# EAGLE design 07_LOAD_DestinationRegister (EAGLE 7.5.0)
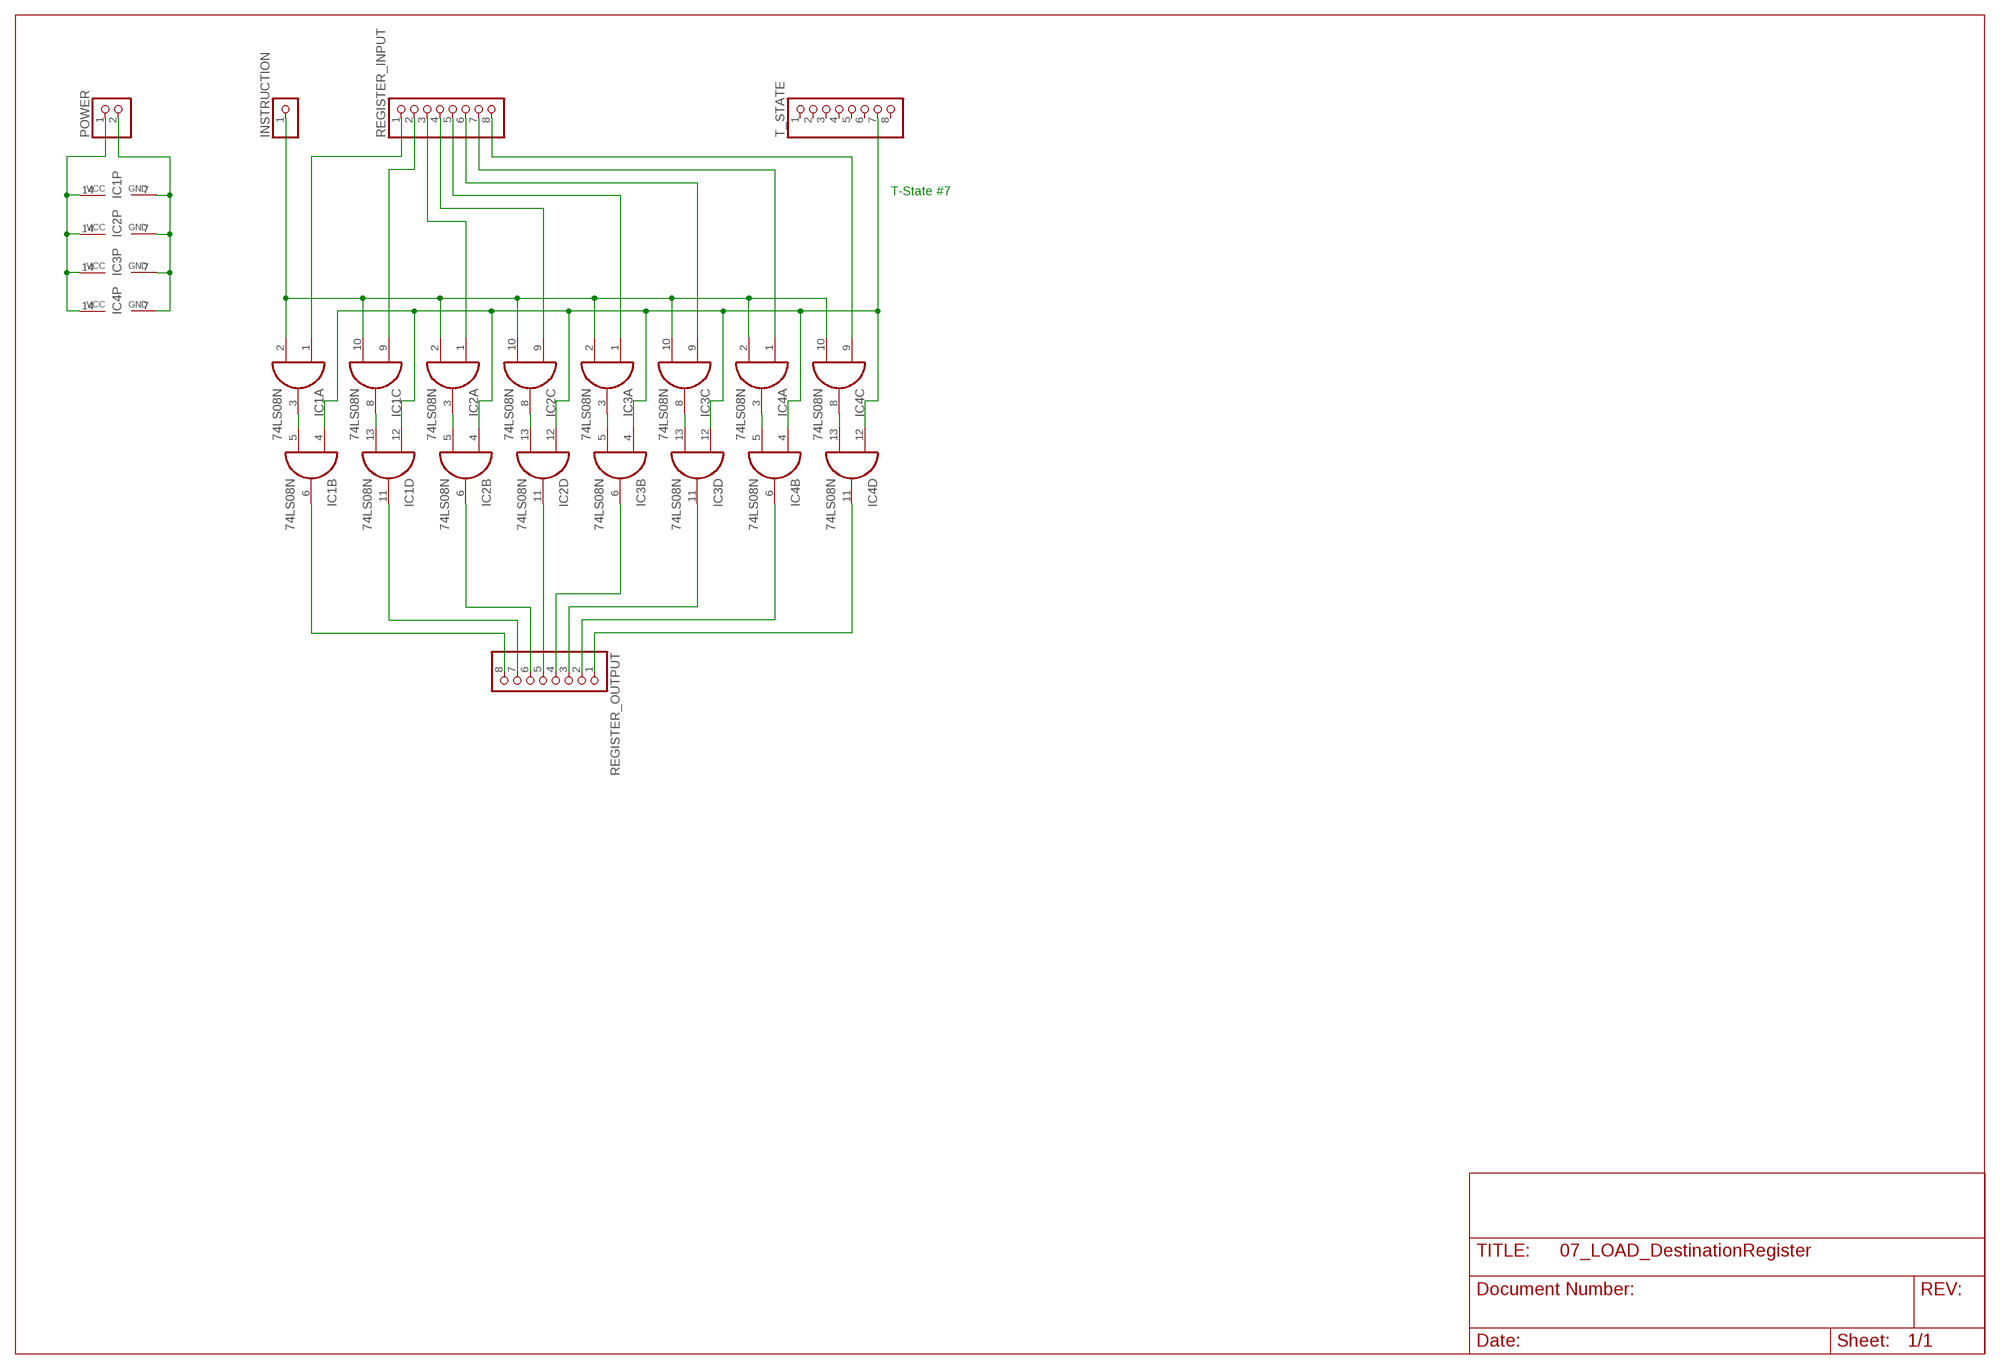
[diagram p0: schematic, sheet 1]

## Parts
IC1  74LS08N  [DIL14]
IC2  74LS08N  [DIL14]
IC3  74LS08N  [DIL14]
IC4  74LS08N  [DIL14]
INSTRUCTION  PINHD-1X1  [1X01]
POWER  PINHD-1X2  [1X02]
REGISTER_INPUT  PINHD-1X8  [1X08]
REGISTER_OUTPUT  PINHD-1X8  [1X08]
T_STATE  PINHD-1X8  [1X08]

## Nets
GND: IC1.7(P:GND) IC2.7(P:GND) IC3.7(P:GND) IC4.7(P:GND) POWER.2
N$1: IC1.2(A:I1) IC1.10(C:I1) IC2.2(A:I1) IC2.10(C:I1) IC3.2(A:I1) IC3.10(C:I1) IC4.2(A:I1) IC4.10(C:I1) INSTRUCTION.1
N$2: IC1.1(A:I0) REGISTER_INPUT.1
N$3: IC1.3(A:O) IC1.5(B:I1)
N$4: IC4.9(C:I0) REGISTER_INPUT.8
N$5: IC1.9(C:I0) REGISTER_INPUT.2
N$6: IC1.8(C:O) IC1.13(D:I1)
N$7: IC2.1(A:I0) REGISTER_INPUT.3
N$8: IC2.3(A:O) IC2.5(B:I1)
N$9: IC2.9(C:I0) REGISTER_INPUT.4
N$10: IC2.8(C:O) IC2.13(D:I1)
N$11: IC3.1(A:I0) REGISTER_INPUT.5
N$12: IC3.3(A:O) IC3.5(B:I1)
N$13: IC3.9(C:I0) REGISTER_INPUT.6
N$14: IC3.8(C:O) IC3.13(D:I1)
N$15: IC4.1(A:I0) REGISTER_INPUT.7
N$16: IC4.3(A:O) IC4.5(B:I1)
N$17: IC1.4(B:I0) IC1.12(D:I0) IC2.4(B:I0) IC2.12(D:I0) IC3.4(B:I0) IC3.12(D:I0) IC4.4(B:I0) IC4.12(D:I0) T_STATE.7
N$18: IC4.8(C:O) IC4.13(D:I1)
N$19: IC1.6(B:O) REGISTER_OUTPUT.8
N$20: IC1.11(D:O) REGISTER_OUTPUT.7
N$21: IC2.6(B:O) REGISTER_OUTPUT.6
N$22: IC2.11(D:O) REGISTER_OUTPUT.5
N$23: IC3.6(B:O) REGISTER_OUTPUT.4
N$24: IC3.11(D:O) REGISTER_OUTPUT.3
N$25: IC4.6(B:O) REGISTER_OUTPUT.2
N$26: IC4.11(D:O) REGISTER_OUTPUT.1
VCC: IC1.14(P:VCC) IC2.14(P:VCC) IC3.14(P:VCC) IC4.14(P:VCC) POWER.1
Unconnected: T_STATE.1 T_STATE.2 T_STATE.3 T_STATE.4 T_STATE.5 T_STATE.6 T_STATE.8

## Notes on the sheet
- T-State #7

## Library data of the parts
IC1-IC4 = 74xx-eu:74*08: Quad 2-input AND gate
INSTRUCTION = pinhead:PINHD-1X1: PIN HEADER
POWER = pinhead:PINHD-1X2: PIN HEADER
REGISTER_INPUT REGISTER_OUTPUT T_STATE = pinhead:PINHD-1X8: PIN HEADER

## Board
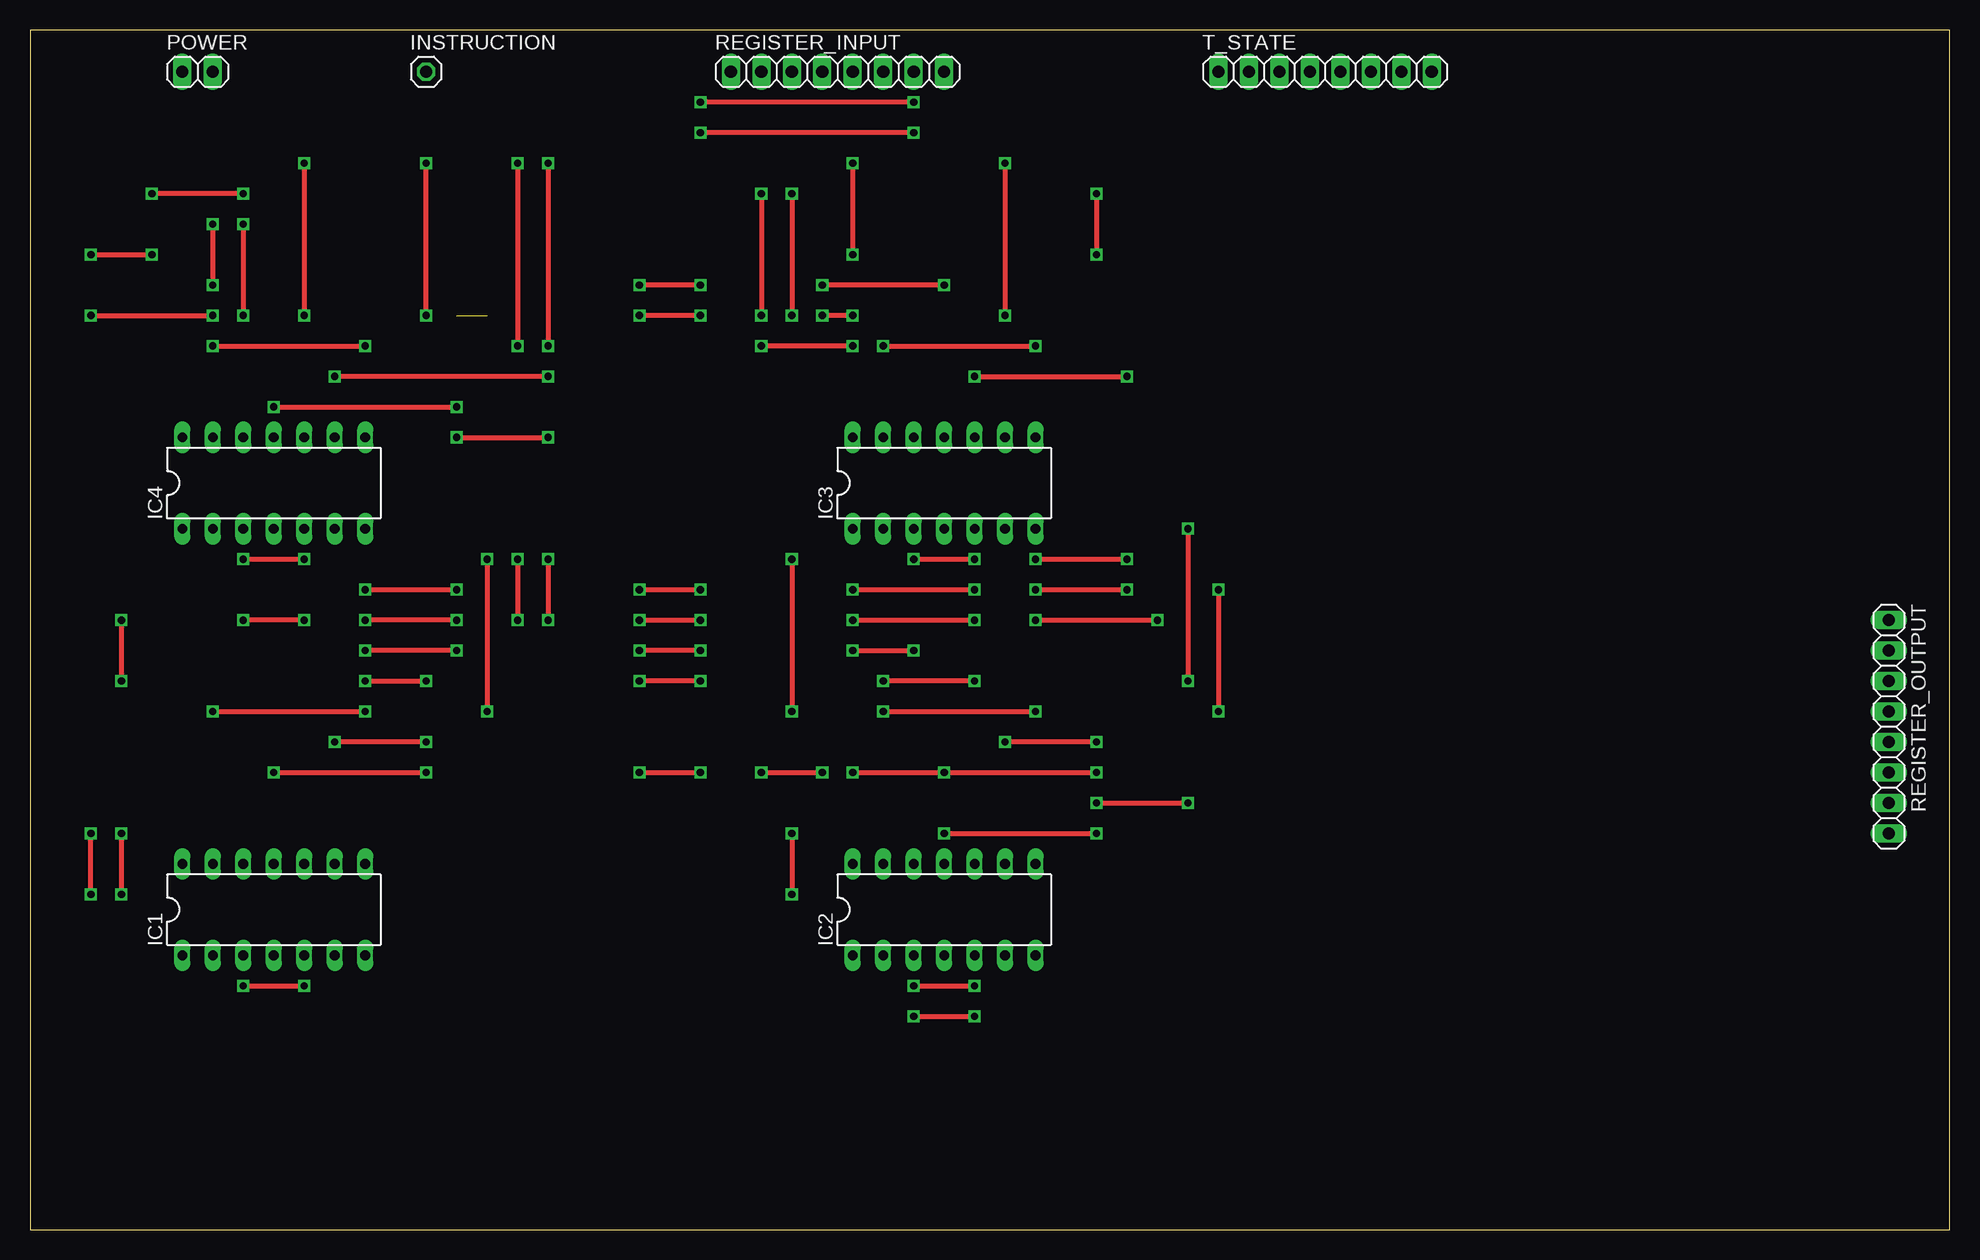
[diagram p1: board, top side]
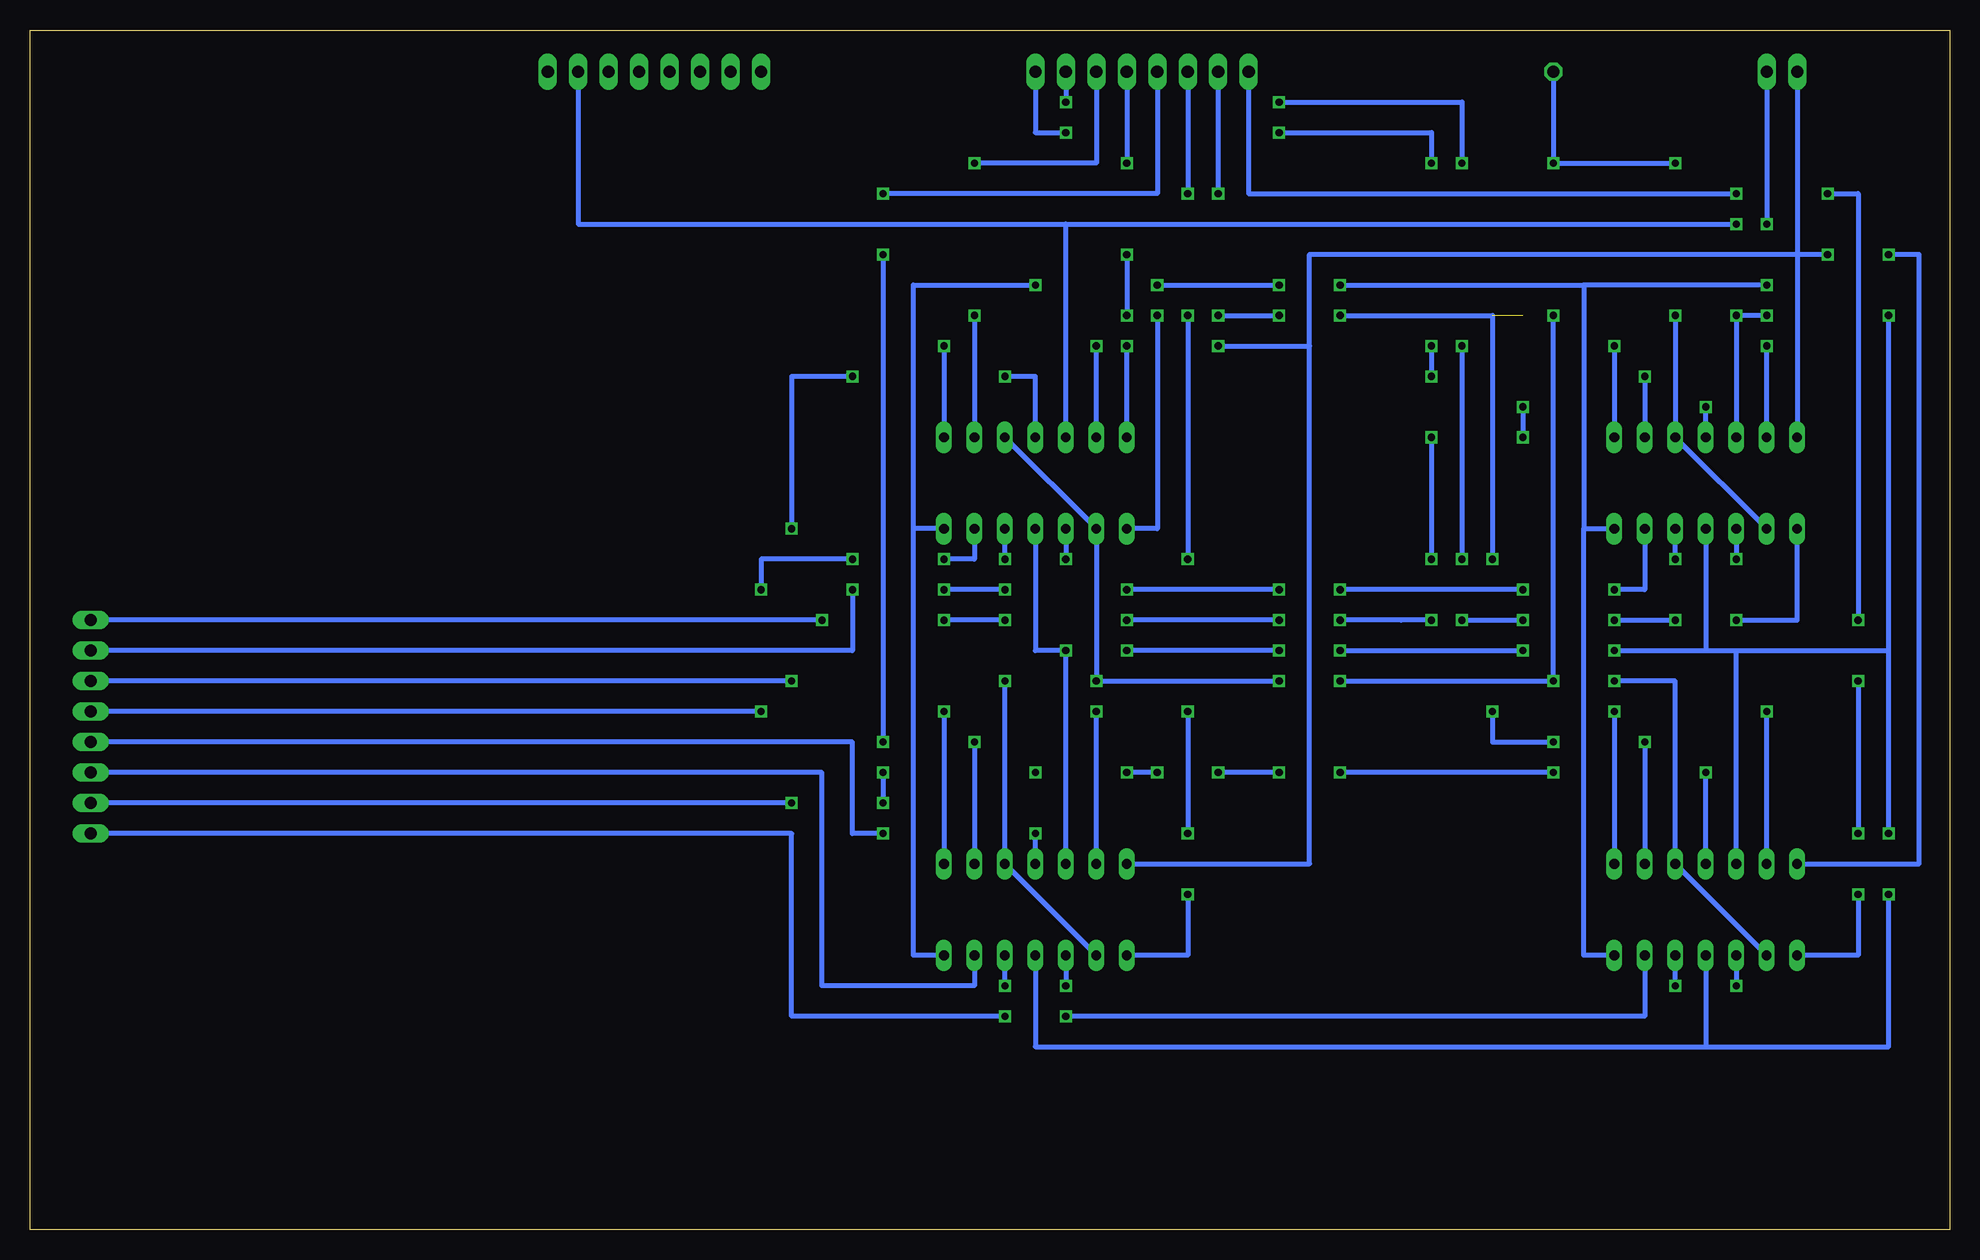
[diagram p2: board, bottom side, seen from below]

Size 160 x 100 mm. Coordinates in mm from the lower left corner, seen from the top.
Outline: 0,0 160,0 160,100 0,100 0,0
Copper layers (1*16): Top 0.035mm / dielectric 1.5mm / Bottom 0.035mm
Design rules "default": minimum track width 10mil, minimum drill 24mil, track to track 8mil, track to pad 8mil, pad to pad 8mil, via to via 8mil, smd to smd 8mil, copper to edge 40mil, drill to drill 8mil, minimum pad ring 10mil, minimum via ring 8mil, stop-mask expansion 4mil, vias tented up to drill 0mil, thermal gap 10mil

### Footprints (pad centres in the part's own frame; a part is rotated, then mirrored left to right if it is on the bottom)
DIL14 = drill 0.813 long: 1 -7.62,-3.81; 2 -5.08,-3.81; 3 -2.54,-3.81; 4 0,-3.81; 5 2.54,-3.81; 6 5.08,-3.81; 7 7.62,-3.81; 8 7.62,3.81; 9 5.08,3.81; 10 2.54,3.81; 11 0,3.81; 12 -2.54,3.81; 13 -5.08,3.81; 14 -7.62,3.81
1X01 = drill 1.016 octagon: 1 0,0
1X02 = drill 1.016 long: 1 -1.27,0; 2 1.27,0
1X08 = drill 1.016 long: 1 -8.89,0; 2 -6.35,0; 3 -3.81,0; 4 -1.27,0; 5 1.27,0; 6 3.81,0; 7 6.35,0; 8 8.89,0

### Placement (x,y rotation side)
IC1  20.32,26.67 0 top
IC2  76.2,26.67 0 top
IC3  76.2,62.23 0 top
IC4  20.32,62.23 0 top
INSTRUCTION  33.02,96.52 0 top
POWER  13.97,96.52 0 top
REGISTER_INPUT  67.31,96.52 0 top
REGISTER_OUTPUT  154.94,41.91 270 top
T_STATE  107.95,96.52 0 top

### Tracks (layer width: path | path; a pad name or v marks a point on that pad's centre or on a via)
GND  (via drill 0.6)
  Top 0.406: v15.24,83.82 v15.24,78.74 | v76.2,78.74 v66.04,78.74 | v55.88,78.74 v50.8,78.74
  Bottom 0.406: POWER.2 v15.24,83.82 | v15.24,78.74 30.48,78.74 | 30.48,78.74 30.48,58.42 | 30.48,58.42 IC4.7 | IC1.7 30.48,22.86 30.48,58.42 | IC3.7 86.36,58.42 | 86.36,58.42 86.36,78.74 v76.2,78.74 | v66.04,78.74 v55.88,78.74 | v50.8,78.74 30.48,78.74 | IC2.7 86.36,22.86 86.36,58.42
N$1  (via drill 0.6)
  Top 0.406: v22.86,88.9 v22.86,76.2 | v27.94,45.72 v33.02,45.72 | v33.02,76.2 v33.02,88.9 | v78.74,45.72 v71.12,45.72 | v55.88,45.72 v50.8,45.72
  Bottom 0.406: INSTRUCTION.1 v33.02,88.9 v22.86,88.9 | v22.86,76.2 IC4.10 IC4.2 | IC1.2 IC1.10 22.86,45.72 v27.94,45.72 | v33.02,76.2 v33.02,45.72 v50.8,45.72 | IC2.2 IC2.10 v78.74,45.72 | v55.88,45.72 v71.12,45.72 IC3.2 IC3.10
N$2  (via drill 0.6)
  Top 0.406: v17.78,86.36 v10.16,86.36 | v7.62,50.8 v7.62,45.72 | v7.62,33.02 v7.62,27.94
  Bottom 0.406: REGISTER_INPUT.1 58.42,86.36 v17.78,86.36 | v10.16,86.36 7.62,86.36 v7.62,50.8 | v7.62,45.72 v7.62,33.02 | v7.62,27.94 7.62,22.86 IC1.1
N$3  (via drill 0.6)
  Top 0.406: v17.78,20.32 v22.86,20.32
  Bottom 0.406: IC1.3 v17.78,20.32 | v22.86,20.32 IC1.5
N$4  (via drill 0.6)
  Top 0.406: v73.66,91.44 v55.88,91.44 | v43.18,88.9 v43.18,73.66 | v43.18,71.12 v25.4,71.12
  Bottom 0.406: REGISTER_INPUT.8 76.2,91.44 v73.66,91.44 | v55.88,91.44 43.18,91.44 v43.18,88.9 | v43.18,73.66 v43.18,71.12 | v25.4,71.12 IC4.9
N$5  (via drill 0.6)  (1 unrouted)
  Top 0.406: v60.96,86.36 v60.96,76.2 | v55.88,76.2 v50.8,76.2 | v38.1,55.88 v38.1,43.18 | v33.02,40.64 v25.4,40.64
  Bottom 0.406: REGISTER_INPUT.2 v60.96,86.36 | v60.96,76.2 v55.88,76.2 | v50.8,76.2 38.1,76.2 v38.1,55.88 | v38.1,43.18 38.1,40.64 v33.02,40.64 | v25.4,40.64 IC1.9
N$6  (via drill 0.6)
  Top 0.406: v15.24,43.18 v27.94,43.18
  Bottom 0.406: IC1.13 v15.24,43.18 | v27.94,43.18 IC1.8
N$7  (via drill 0.6)
  Top 0.406: v63.5,86.36 v63.5,76.2 | v63.5,55.88 v63.5,43.18 | v63.5,33.02 v63.5,27.94
  Bottom 0.406: REGISTER_INPUT.3 v63.5,86.36 | v63.5,76.2 v63.5,55.88 | v63.5,43.18 v63.5,33.02 | v63.5,27.94 63.5,22.86 IC2.1
N$8  (via drill 0.6)
  Top 0.406: v73.66,20.32 v78.74,20.32
  Bottom 0.406: IC2.3 v73.66,20.32 | v78.74,20.32 IC2.5
N$9  (via drill 0.6)
  Top 0.406: v88.9,86.36 v88.9,81.28 | v88.9,40.64 v81.28,40.64
  Bottom 0.406: REGISTER_INPUT.4 66.04,86.36 v88.9,86.36 | v88.9,81.28 v88.9,40.64 | v81.28,40.64 IC2.9
N$10  (via drill 0.6)
  Top 0.406: v71.12,43.18 v83.82,43.18
  Bottom 0.406: IC2.13 v71.12,43.18 | v83.82,43.18 IC2.8
N$11  (via drill 0.6)
  Top 0.406: v68.58,88.9 v68.58,81.28 | v68.58,76.2 v66.04,76.2
  Bottom 0.406: REGISTER_INPUT.5 v68.58,88.9 | v68.58,81.28 v68.58,76.2 | v66.04,76.2 66.04,58.42 IC3.1
N$12  (via drill 0.6)
  Top 0.406: v73.66,55.88 v78.74,55.88
  Bottom 0.406: IC3.3 v73.66,55.88 | v78.74,55.88 IC3.5
N$13  (via drill 0.6)
  Top 0.406: v81.28,88.9 v81.28,76.2
  Bottom 0.406: REGISTER_INPUT.6 71.12,88.9 v81.28,88.9 | v81.28,76.2 IC3.9
N$14  (via drill 0.6)
  Top 0.406: v71.12,73.66 v83.82,73.66
  Bottom 0.406: IC3.13 v71.12,73.66 | v83.82,73.66 IC3.8
N$15  (via drill 0.6)
  Top 0.406: v73.66,93.98 v55.88,93.98 | v40.64,88.9 v40.64,73.66 | v35.56,50.8 v27.94,50.8 | v22.86,50.8 v17.78,50.8 | v40.64,55.88 v40.64,50.8
  Bottom 0.406: REGISTER_INPUT.7 v73.66,93.98 | v55.88,93.98 40.64,93.98 v40.64,88.9 | v35.56,50.8 38.1,50.8 v40.64,50.8 | v27.94,50.8 v22.86,50.8 | v17.78,50.8 12.7,50.8 IC4.1 | v40.64,73.66 v40.64,55.88
N$16  (via drill 0.6)
  Top 0.406: v17.78,55.88 v22.86,55.88
  Bottom 0.406: IC4.3 v17.78,55.88 | v22.86,55.88 IC4.5
N$17  (via drill 0.6)
  Top 0.406: v17.78,83.82 v17.78,76.2 | v5.08,76.2 v15.24,76.2 | v55.88,48.26 v50.8,48.26 | v35.56,48.26 v27.94,48.26 | v5.08,27.94 v5.08,33.02 | v68.58,48.26 v73.66,48.26
  Bottom 0.406: T_STATE.7 114.3,83.82 73.66,83.82 | 73.66,83.82 v17.78,83.82 | IC4.12 v17.78,76.2 v15.24,76.2 | IC4.4 20.32,48.26 | 20.32,48.26 17.78,48.26 | 17.78,48.26 5.08,48.26 | 5.08,48.26 v5.08,76.2 | IC3.4 76.2,48.26 v73.66,48.26 IC2.12 | v50.8,48.26 v35.56,48.26 | v27.94,48.26 20.32,48.26 | IC1.12 17.78,48.26 | IC1.4 20.32,15.24 | 20.32,15.24 5.08,15.24 v5.08,27.94 | v5.08,33.02 5.08,48.26 | IC2.4 76.2,15.24 20.32,15.24 | v55.88,48.26 v68.58,48.26 | IC3.12 73.66,83.82
N$18  (via drill 0.6)
  Top 0.406: v15.24,73.66 v27.94,73.66
  Bottom 0.406: IC4.13 v15.24,73.66 | v27.94,73.66 IC4.8
N$19  (via drill 0.6)
  Top 0.406: v73.66,17.78 v78.74,17.78
  Bottom 0.406: IC1.6 25.4,17.78 v73.66,17.78 | v78.74,17.78 96.52,17.78 96.52,33.02 REGISTER_OUTPUT.8
N$20  (via drill 0.6)
  Top 0.406: v20.32,38.1 v33.02,38.1 | v50.8,38.1 v55.88,38.1 | v60.96,38.1 v66.04,38.1 | v68.58,38.1 v76.2,38.1 v88.9,38.1 | v88.9,35.56 v96.52,35.56
  Bottom 0.406: IC1.11 v20.32,38.1 | v33.02,38.1 v50.8,38.1 | v55.88,38.1 v60.96,38.1 | v66.04,38.1 v68.58,38.1 | v88.9,38.1 v88.9,35.56 | v96.52,35.56 REGISTER_OUTPUT.7
N$21
  Bottom 0.406: IC2.6 81.28,20.32 93.98,20.32 93.98,38.1 REGISTER_OUTPUT.6
N$22  (via drill 0.6)
  Top 0.406: v76.2,33.02 v88.9,33.02
  Bottom 0.406: IC2.11 v76.2,33.02 | v88.9,33.02 91.44,33.02 91.44,40.64 REGISTER_OUTPUT.5
N$23  (via drill 0.6)
  Top 0.406: v83.82,55.88 v91.44,55.88 | v99.06,53.34 v99.06,43.18
  Bottom 0.406: IC3.6 81.28,55.88 v83.82,55.88 | v91.44,55.88 99.06,55.88 v99.06,53.34 | v99.06,43.18 REGISTER_OUTPUT.4
N$24  (via drill 0.6)
  Top 0.406: v78.74,71.12 v91.44,71.12 | v96.52,58.42 v96.52,45.72
  Bottom 0.406: IC3.11 76.2,71.12 v78.74,71.12 | v91.44,71.12 96.52,71.12 v96.52,58.42 | v96.52,45.72 REGISTER_OUTPUT.3
N$25  (via drill 0.6)
  Top 0.406: v27.94,53.34 v35.56,53.34 | v50.8,53.34 v55.88,53.34 | v68.58,53.34 v78.74,53.34 | v83.82,53.34 v91.44,53.34
  Bottom 0.406: IC4.6 25.4,53.34 v27.94,53.34 | v35.56,53.34 v50.8,53.34 | v55.88,53.34 v68.58,53.34 | v78.74,53.34 v83.82,53.34 | v91.44,53.34 91.44,48.26 REGISTER_OUTPUT.2
N$26  (via drill 0.6)
  Top 0.406: v20.32,68.58 v35.56,68.58 | v35.56,66.04 v43.18,66.04 | v50.8,50.8 v55.88,50.8 | v68.58,50.8 v78.74,50.8 | v83.82,50.8 v93.98,50.8 | v43.18,55.88 v43.18,50.8
  Bottom 0.406: IC4.11 v20.32,68.58 | v35.56,68.58 v35.56,66.04 | v50.8,50.8 45.72,50.8 v43.18,50.8 | v55.88,50.8 v68.58,50.8 | v78.74,50.8 v83.82,50.8 | v93.98,50.8 REGISTER_OUTPUT.1 | v43.18,66.04 v43.18,55.88
VCC  (via drill 0.6)
  Top 0.406: v5.08,81.28 v10.16,81.28 | v68.58,73.66 v60.96,73.66
  Bottom 0.406: IC1.14 2.54,30.48 2.54,81.28 v5.08,81.28 | IC2.14 53.34,30.48 53.34,73.66 | 53.34,73.66 53.34,81.28 12.7,81.28 | POWER.1 12.7,81.28 | 12.7,81.28 IC4.14 | v10.16,81.28 12.7,81.28 | IC3.14 v68.58,73.66 | v60.96,73.66 53.34,73.66